# EAGLE design DMGC-CPU-01_1-3 (EAGLE 9.6.2)
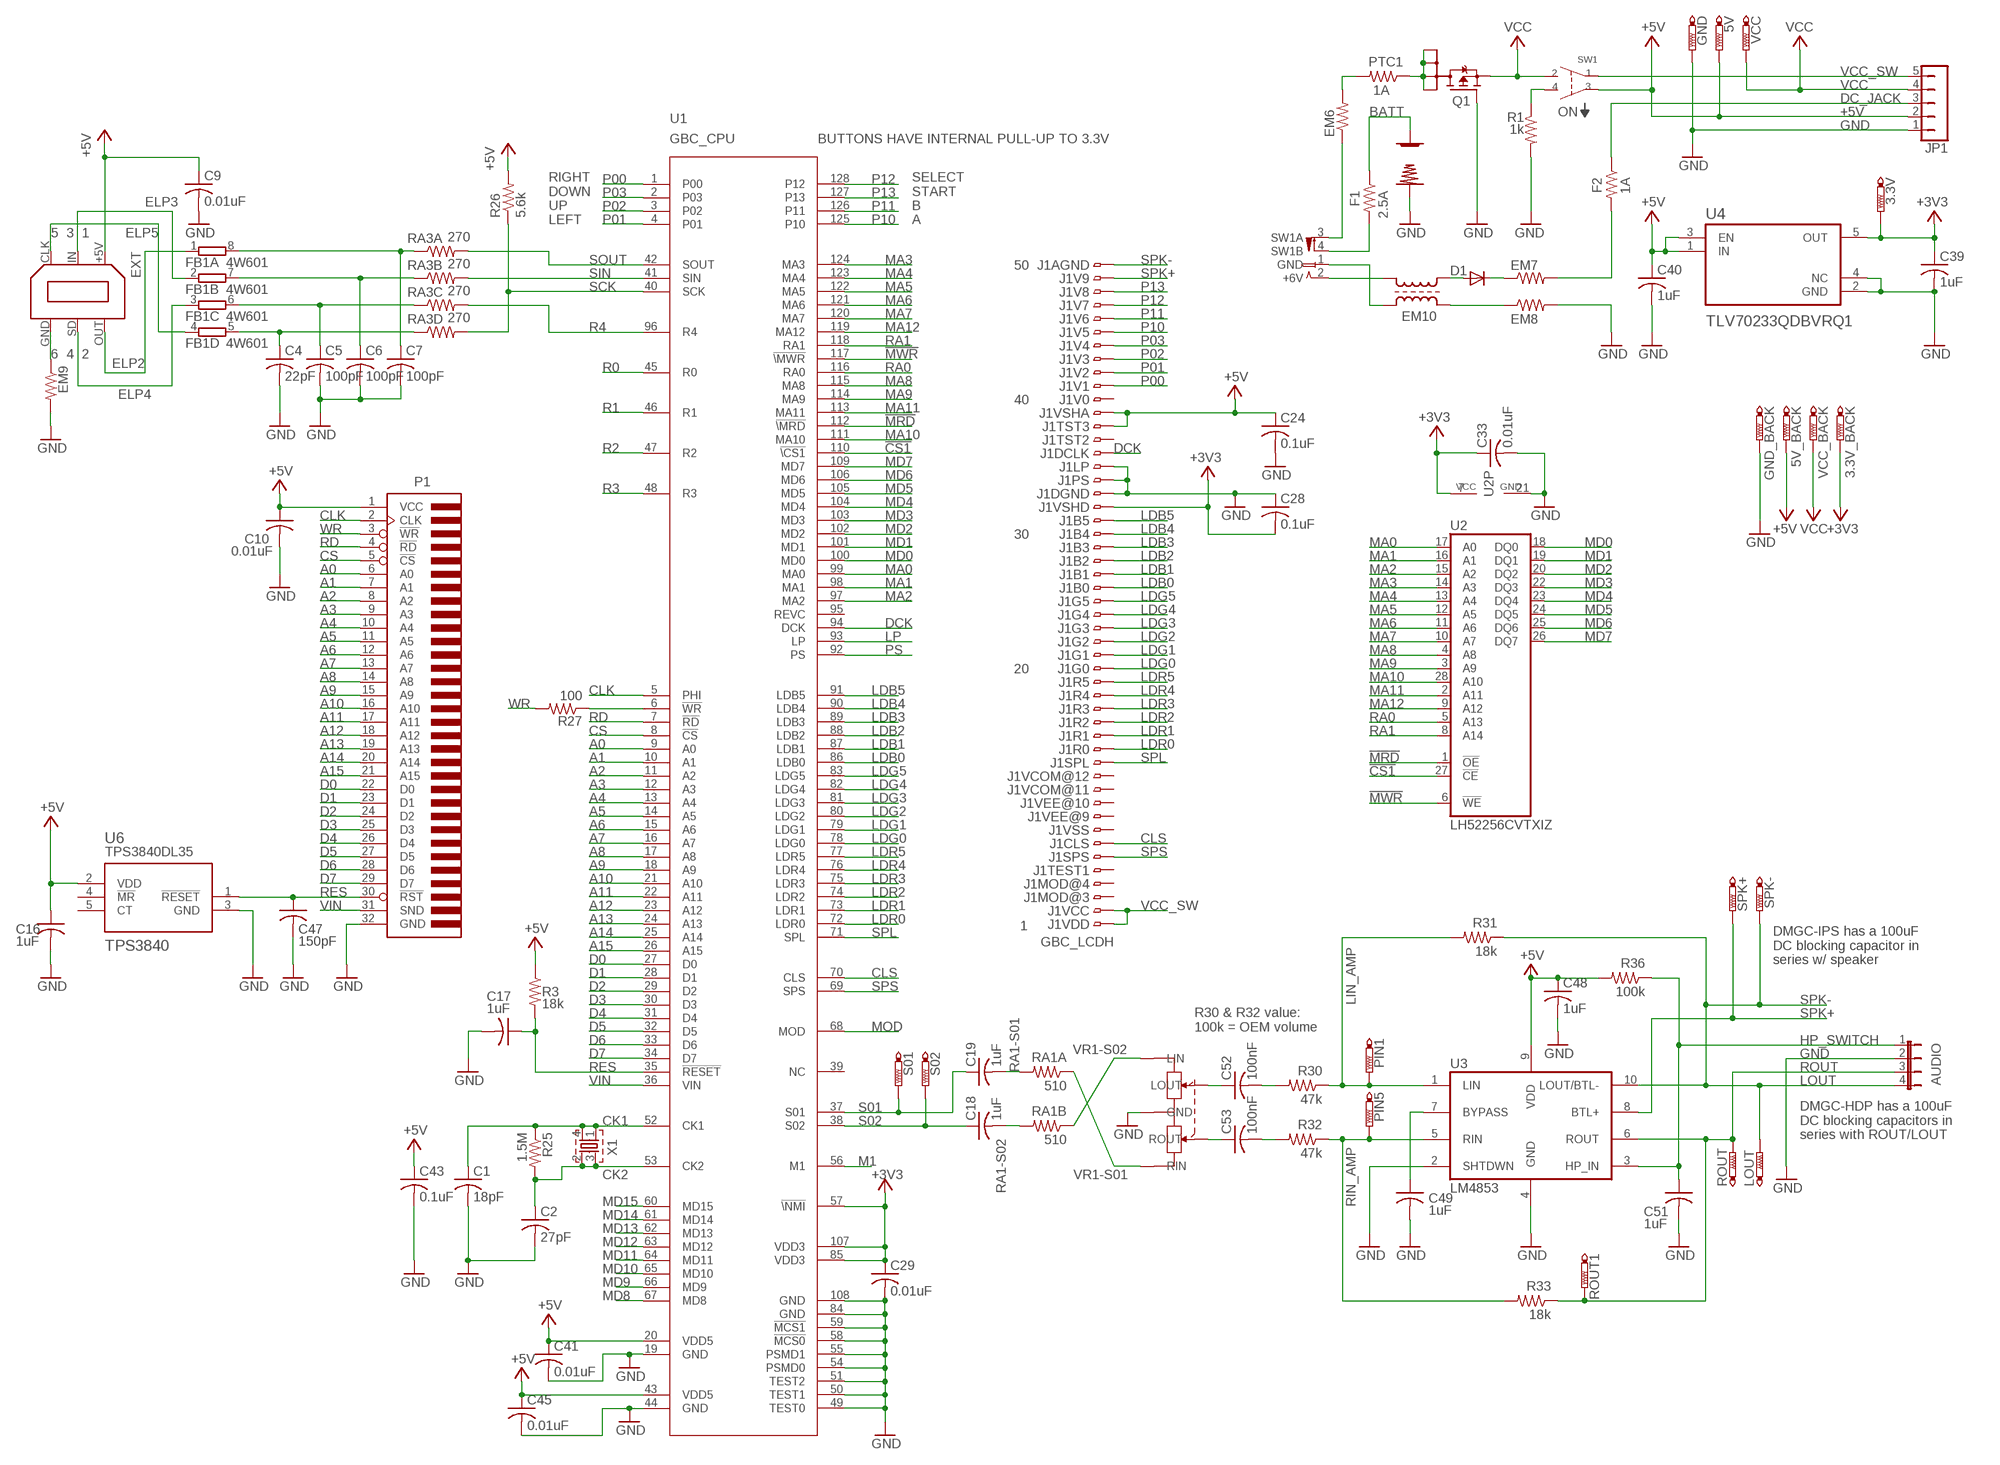
[diagram p0: schematic, sheet 1]

## Parts
3.3V  PTR1B1,27  [B1,27]
3.3V_BACK  PTR1B1,27  [B1,27]
5V  PTR1B1,27  [B1,27]
5V_BACK  PTR1B1,27  [B1,27]
+  DMG+BATTERY  [DMG+BATTERY]
-  DMG-BATTERY  [DMG-BATTERY]
AUDIO  JP4E  [JP4]
C1  18pF  C-USC0603  [C0603]
C2  27pF  C-USC0603  [C0603]
C4  22pF  C-USC0603  [C0603]
C5  100pF  C-USC0603  [C0603]
C6  100pF  C-USC0603  [C0603]
C7  100pF  C-USC0603  [C0603]
C9  0.01uF  C-USC0603  [C0603]
C10  0.01uF  C-USC0603  [C0603]
C16  1uF  C-USC0603  [C0603]
C17  1uF  C-USC0603  [C0603]
C18  1uF  C-USC0603  [C0603]
C19  1uF  C-USC0603  [C0603]
C24  0.1uF  C-USC0603  [C0603]
C28  0.1uF  C-USC0603  [C0603]
C29  0.01uF  C-USC0603  [C0603]
C33  0.01uF  C-USC0603  [C0603]
C39  1uF  C-USC0603  [C0603]
C40  1uF  C-USC0603  [C0603]
C41  0.01uF  C-USC0603  [C0603]
C43  0.1uF  C-USC0603  [C0603]
C45  0.01uF  C-USC0603  [C0603]
C47  150pF  C-USC0603  [C0603]
C48  1uF  C-USC0603  [C0603]
C49  1uF  C-USC0603  [C0603]
C51  1uF  C-USC0603  [C0603]
C52  100nF  C-USC0603  [C0603]
C53  100nF  C-USC0603  [C0603]
D1  CGRM4001-G  [SOD-123_MINI-SMA]
DCJACK  DMG-PWRJACKNOHOLE  [DMG-PWRJACK_NOHOLE]
EM6  BLM21P221SG  R-US_R0805  [R0805]
EM7  BLM21P221SG  R-US_R0805  [R0805]
EM8  BLM21P221SG  R-US_R0805  [R0805]
EM9  BLM21P221SG  R-US_R0603  [R0603]
EM10  ACM4532-801-2PA  [ACM4532]
EXT  LINKPORTDMG-LINK-SHORT  LINKPORTDMG-LINK  [DMG-LINK]
F1  2.5A  R-US_R1206  [R1206]
F2  1A  R-US_R1206  [R1206]
FB1  4W601  4R-NEXB38V  [EXB38V]
GND  PTR1B1,27  [B1,27]
GND_BACK  PTR1B1,27  [B1,27]
J1  GBC_LCDH  [FH12-50S-0.5SH]
JP1  JP5  [JP5]
LOUT  PTR1B1,27  [B1,27]
P1  GBCONN  [GBCONN]
PIN1  PTR1B1,27  [B1,27]
PIN5  PTR1B1,27  [B1,27]
PTC1  1A  R-US_R1206  [R1206]
Q1  SI1401EDH  [SOT363_INFINEON]
R1  1k  R-US_R0603  [R0603]
R3  18k  R-US_R0603  [R0603]
R25  1.5M  R-US_R0603  [R0603]
R26  5.6k  R-US_R0603  [R0603]
R27  100  R-US_R0603  [R0603]
R30  47k  R-US_R0603  [R0603]
R31  18k  R-US_R0603  [R0603]
R32  47k  R-US_R0603  [R0603]
R33  18k  R-US_R0603  [R0603]
R36  100k  R-US_R0603  [R0603]
RA1A  510  R-US_R0603  [R0603]
RA1B  510  R-US_R0603  [R0603]
RA3A  270  R-US_R0603  [R0603]
RA3B  270  R-US_R0603  [R0603]
RA3C  270  R-US_R0603  [R0603]
RA3D  270  R-US_R0603  [R0603]
ROUT  PTR1B1,27  [B1,27]
ROUT1  PTR1B1,27  [B1,27]
S01  PTR1B1,27  [B1,27]
S02  PTR1B1,27  [B1,27]
SPK+  PTR1B1,27  [B1,27]
SPK-  PTR1B1,27  [B1,27]
SW1  DMG-SW  [DMG-SWITCH]
U1  GBC_CPU  [QFP-128]
U2  LH52256CVTXIZ  [TSOP1-28]
U3  LM4853  [VSSOP10]
U4  TLV70233QDBVRQ1  [SOT95P280X145-5N]
U6  TPS3840  [SOT-23-5]
VCC  PTR1B1,27  [B1,27]
VCC_BACK  PTR1B1,27  [B1,27]
VR1  10K  DMG-POT  [DMG-POT]
X1  8.388608MHZ12SMX-B-4-PAD  [7.5X5-4-PAD]

## Nets
!CS1: U1.110(!\CS1) U2.27(!CE)
!MRD: U1.112(!\MRD) U2.1(!OE)
!MWR: U1.117(!\MWR) U2.6(!WE)
+3V3: 3.3V.TP 3.3V_BACK.TP C28.2 C29.1 C33.1 C39.1 J1.32 U1.57(!\NMI) U1.85(VDD3) U1.107(VDD3) U2.7(VCC) U4.5(OUT)
+5V: 5V.TP 5V_BACK.TP C9.1 C10.1 C16.1 C24.1 C40.1 C41.1 C43.1 C45.1 C48.1 EXT.+5V J1.38 J1.39 JP1.2 P1.1(VCC) R3.1 R26.2 R36.2 SW1.P$3 U1.20(VDD5) U1.43(VDD5) U3.9(VDD) U4.1(IN) U4.3(EN) U6.2(VDD)
A0: P1.6(A0) U1.9(A0)
A1: P1.7(A1) U1.10(A1)
A2: P1.8(A2) U1.11(A2)
A3: P1.9(A3) U1.12(A3)
A4: P1.10(A4) U1.13(A4)
A5: P1.11(A5) U1.14(A5)
A6: P1.12(A6) U1.15(A6)
A7: P1.13(A7) U1.16(A7)
A8: P1.14(A8) U1.17(A8)
A9: P1.15(A9) U1.18(A9)
A10: P1.16(A10) U1.21(A10)
A11: P1.17(A11) U1.22(A11)
A12: P1.18(A12) U1.23(A12)
A13: P1.19(A13) U1.24(A13)
A14: P1.20(A14) U1.25(A14)
A15: P1.21(A15) U1.26(A15)
BATT: +.P$1 F1.1
BATT_DC: DCJACK.3(SW1A) EM6.1
CK1: C1.1 R25.1 U1.52(CK1) X1.1 X1.4
CK2: C2.1 R25.2 U1.53(CK2) X1.2 X1.3
CLK: P1.2(CLK) U1.5(PHI)
CLS: J1.7 U1.70(CLS)
CS: P1.5(!CS) U1.8(!CS)
D0: P1.22(D0) U1.27(D0)
D1: P1.23(D1) U1.28(D1)
D2: P1.24(D2) U1.29(D2)
D3: P1.25(D3) U1.30(D3)
D4: P1.26(D4) U1.31(D4)
D5: P1.27(D5) U1.32(D5)
D6: P1.28(D6) U1.33(D6)
D7: P1.29(D7) U1.34(D7)
DC_JACK: F2.1 JP1.3
DCK: J1.36 U1.94(DCK)
ELP2: EXT.OUT FB1.1
ELP3: EXT.IN FB1.2
ELP4: EXT.SD FB1.3
ELP5: EXT.CLK FB1.4
EM10_EM8: EM8.1 EM10.3
EM10_GND: DCJACK.1(GND) EM10.2
EM10_POS: DCJACK.2(+6V) EM10.1
GND: -.P$1 AUDIO.2 C1.2 C2.2 C4.2 C5.2 C6.2 C7.2 C9.2 C10.2 C16.2 C17.2 C24.2 C28.1 C29.2 C33.2 C39.2 C40.2 C41.2 C43.2 C45.2 C47.2 C48.2 C49.2 C51.2 EM8.2 EM9.2 GND.TP GND_BACK.TP J1.33 J1.34 J1.35 JP1.1 P1.32(GND) Q1.3(G) R1.2 U1.19(GND) U1.44(GND) U1.49(TEST0) U1.50(TEST1) U1.51(TEST2) U1.54(PSMD0) U1.55(PSMD1) U1.58(!MCS0) U1.59(!MCS1) U1.84(GND) U1.108(GND) U2.21(GND) U3.2(SHTDWN) U3.4(GND) U4.2(GND) U4.4(NC) U6.3(GND) VR1.P$1(GND)
HP_SWITCH: AUDIO.1 C51.1 R36.1 U3.3(HP_IN)
LDB0: J1.26 U1.86(LDB0)
LDB1: J1.27 U1.87(LDB1)
LDB2: J1.28 U1.88(LDB2)
LDB3: J1.29 U1.89(LDB3)
LDB4: J1.30 U1.90(LDB4)
LDB5: J1.31 U1.91(LDB5)
LDG0: J1.20 U1.78(LDG0)
LDG1: J1.21 U1.79(LDG1)
LDG2: J1.22 U1.80(LDG2)
LDG3: J1.23 U1.81(LDG3)
LDG4: J1.24 U1.82(LDG4)
LDG5: J1.25 U1.83(LDG5)
LDR0: J1.14 U1.72(LDR0)
LDR1: J1.15 U1.73(LDR1)
LDR2: J1.16 U1.74(LDR2)
LDR3: J1.17 U1.75(LDR3)
LDR4: J1.18 U1.76(LDR4)
LDR5: J1.19 U1.77(LDR5)
LIN_AMP: PIN1.TP R30.1 R31.2 U3.1(LIN)
LP: U1.93(LP)
M1: U1.56(M1)
MA0: U1.99(MA0) U2.17(A0)
MA1: U1.98(MA1) U2.16(A1)
MA2: U1.97(MA2) U2.15(A2)
MA3: U1.124(MA3) U2.14(A3)
MA4: U1.123(MA4) U2.13(A4)
MA5: U1.122(MA5) U2.12(A5)
MA6: U1.121(MA6) U2.11(A6)
MA7: U1.120(MA7) U2.10(A7)
MA8: U1.115(MA8) U2.4(A8)
MA9: U1.114(MA9) U2.3(A9)
MA10: U1.111(MA10) U2.28(A10)
MA11: U1.113(MA11) U2.2(A11)
MA12: U1.119(MA12) U2.9(A12)
MD0: U1.100(MD0) U2.18(DQ0)
MD1: U1.101(MD1) U2.19(DQ1)
MD2: U1.102(MD2) U2.20(DQ2)
MD3: U1.103(MD3) U2.22(DQ3)
MD4: U1.104(MD4) U2.23(DQ4)
MD5: U1.105(MD5) U2.24(DQ5)
MD6: U1.106(MD6) U2.25(DQ6)
MD7: U1.109(MD7) U2.26(DQ7)
MD8: U1.67(MD8)
MD9: U1.66(MD9)
MD10: U1.65(MD10)
MD11: U1.64(MD11)
MD12: U1.63(MD12)
MD13: U1.62(MD13)
MD14: U1.61(MD14)
MD15: U1.60(MD15)
MOD: U1.68(MOD)
N$1: C7.1 FB1.8 RA3A.1
N$2: C6.1 FB1.7 RA3B.1
N$4: C52.2 R30.2
N$5: C53.2 R32.2
N$6: C5.1 FB1.6 RA3C.1
N$7: C52.1 VR1.P$3(LOUT)
N$8: R27.1 U1.6(!WR)
N$9: C4.1 FB1.5 RA3D.1
N$10: C53.1 VR1.P$2(ROUT)
N$11: R1.1 SW1.P$4
N$13: D1.C EM7.1
N$15: EM7.2 F2.2
N$16: EM6.2 PTC1.2
N$24: EM9.1 EXT.GND
N$29: C49.1 U3.7(BYPASS)
P00: J1.41 U1.1(P00)
P01: J1.42 U1.4(P01)
P02: J1.43 U1.3(P02)
P03: J1.44 U1.2(P03)
P10: J1.45 U1.125(P10)
P11: J1.46 U1.126(P11)
P12: J1.47 U1.128(P12)
P13: J1.48 U1.127(P13)
PFET_DRAIN: PTC1.1 Q1.1(D1) Q1.2(D2) Q1.5(D5) Q1.6(D6)
PS: U1.92(PS)
R0: U1.45(R0)
R1: U1.46(R1)
R2: U1.47(R2)
R3: U1.48(R3)
R4: RA3C.2 U1.96(R4)
RA0: U1.116(RA0) U2.5(A13)
RA1: U1.118(RA1) U2.8(A14)
RA1-S01: C19.2 RA1A.2
RA1-S02: C18.2 RA1B.2
RD: P1.4(!RD) U1.7(!RD)
RES: C17.1 C47.1 P1.30(!RST) R3.2 U1.35(!RESET) U6.1(!RESET)
RIN_AMP: PIN5.TP R32.1 R33.2 U3.5(RIN)
ROUT: AUDIO.3 R33.1 ROUT1.TP ROUT.TP U3.6(ROUT)
RPP: D1.A EM10.4
S01: C19.1 S01.TP U1.37(S01)
S02: C18.1 S02.TP U1.38(S02)
SCK: R26.1 RA3D.2 U1.40(SCK)
SIN: RA3B.2 U1.41(SIN)
SOUT: RA3A.2 U1.42(SOUT)
SPK+: J1.49 SPK+.TP U3.8(BTL+)
SPK-: AUDIO.4 J1.50 LOUT.TP R31.1 SPK-.TP U3.10(LOUT/BTL-)
SPL: J1.13 U1.71(SPL)
SPS: J1.6 U1.69(SPS)
SW1B: DCJACK.4(SW1B) F1.2
VCC: JP1.4 Q1.4(S) SW1.P$2 VCC.TP VCC_BACK.TP
VCC_SW: J1.1 J1.2 JP1.5 SW1.P$1
VIN: P1.31(SND) U1.36(VIN)
VR1-S01: RA1A.1 VR1.P$5(RIN)
VR1-S02: RA1B.1 VR1.P$4(LIN)
WR: P1.3(!WR) R27.2
Unconnected: J1.3 J1.4 J1.5 J1.8 J1.9 J1.10 J1.11 J1.12 J1.37 J1.40 U1.39(NC) U1.95(REVC) U6.4(!MR) U6.5(CT)

## Notes on the sheet
- BUTTONS HAVE INTERNAL PULL-UP TO 3.3V
- RIGHT
  DOWN
  UP
  LEFT
- SELECT
  START
  B
  A
- 5  3  1
- 50
- 6  4  2
- 40
- 30
- 20
- TPS3840DL35
- 1
- DMGC-IPS has a 100uF 
  DC blocking capacitor in
  series w/ speaker
- R30 & R32 value:
  100k = OEM volume
- LOUT
- DMGC-HDP has a 100uF 
  DC blocking capacitors in
  series with ROUT/LOUT

## Power pins joined to a net without a drawn wire
GND: EXT.SHIELD1(GND) EXT.SHIELD(GND) SW1.P$7(GND) SW1.P$8(GND) VR1.P$6(GND) VR1.P$7(GND)

## Library data of the parts
3.3V 3.3V_BACK 5V 5V_BACK GND GND_BACK LOUT PIN1 PIN5 ROUT ROUT1 S01 S02 SPK+ SPK- VCC VCC_BACK = testpad:PTR1: TEST PIN
+ = Game Boy:DMG+BATTERY
- = Game Boy:DMG-BATTERY
AUDIO = jumper:JP4E: JUMPER
C1 C2 C4-C7 C9 C10 C16-C19 C24 C28 C29 C33 C39-C41 C43 C45 C47-C49 C51-C53 = rcl:C-US: CAPACITOR, American symbol; SPICEPREFIX: C
D1 = diode:CGRM400*-G: Molded plasitc,JEDEC SOD-123/Mini SMA Source: Comchip CGRM4001-G.pdf
DCJACK = Game Boy:DMG-PWRJACK
EM6-EM9 F1 F2 PTC1 R1 R3 R25-R27 R30-R33 R36 RA1A RA1B RA3A RA3B RA3C RA3D = rcl:R-US_: RESISTOR, American symbol; SPICEPREFIX: R
EM10 = gameboy:ACM4532-801-2P: TRANSFORMER SMD transformer; OC_FARNELL: unknown; OC_NEWARK: unknown
EXT = Game Boy:LINKPORT
FB1 = resistor-dil:4R-N: Array Chip Resistor Source: RS Component / Phycomp; OC_FARNELL: unknown; OC_NEWARK: unknown
J1 = gameboy:GBC_LCD: 0.5mm Pitch Connectors For FPC/FFC Source: Data sheet <http://www.hirose.co.jp/cataloge_hp/e58605370.pdf>; MPN: FH12-50S-0.5SH(55); OC_FARNELL: 1324557; OC_NEWARK: 34M6181
JP1 = jumper:JP5: JUMPER
P1 = GameboyDev:GBCONN
Q1 = transistor-fet:SI1401EDH: OptiMOS(R)-P Small-Signal-Transistor Dual P-Channel, Enhancement mode, Super Logic Level (2.5 V rated) Source: http://www.infineon.com/upload/Document/BSD223P_Rev1.3.pdf
SW1 = Game Boy:DMG-SW: DMG Power Switch Pins 1 and 2 are only connected when the power is ON, pins 3 and 4 are only connected when the power is OFF.
U1 = gameboy:GBC_CPU: lfxp3e_tqfp144 edit this description Auto generated by make-symbol-device-package-bsdl.ulp Rev. 20 Source: lfxp3e_tqfp144.bsm
U2 = gameboy:LH52256CVT: 256K (32K x 8) CMOS-Static RAM Source: http://download.cypress.com.edgesuite.net/design_resources/datasheets/contents/cy62256_8.pdf
U3 = gameboy:LM4853: LM4853
U4 = TLV70233QDBVRQ1:TLV70233QDBVRQ1: Check availability <https://pricing.snapeda.com/parts/TLV70233QDBVRQ1/Texas%20Instruments/view-part?ref=eda>; AVAILABILITY: In Stock; DESCRIPTION: Automotive 300-mA, high-PSRR, low-IQ, low-dropout voltage regulator with enable 5-SOT-23 -40 to 125; MF: Texas Instruments; MP: TLV70233QDBVRQ1; PACKAGE: SOT-23-5 Texas Instruments; PRICE: None; PURCHASE-URL: https://pricing.snapeda.com/search/part/TLV70233QDBVRQ1/?ref=eda
U6 = SOT95P280X145-5N:TPS3840
VR1 = Game Boy:DMG-POT
X1 = gameboy:8.388608MHZ: CRYSTALS WITH CAN GROUNDED

## Net classes
1 VCC: width 0.203 mm

## Board
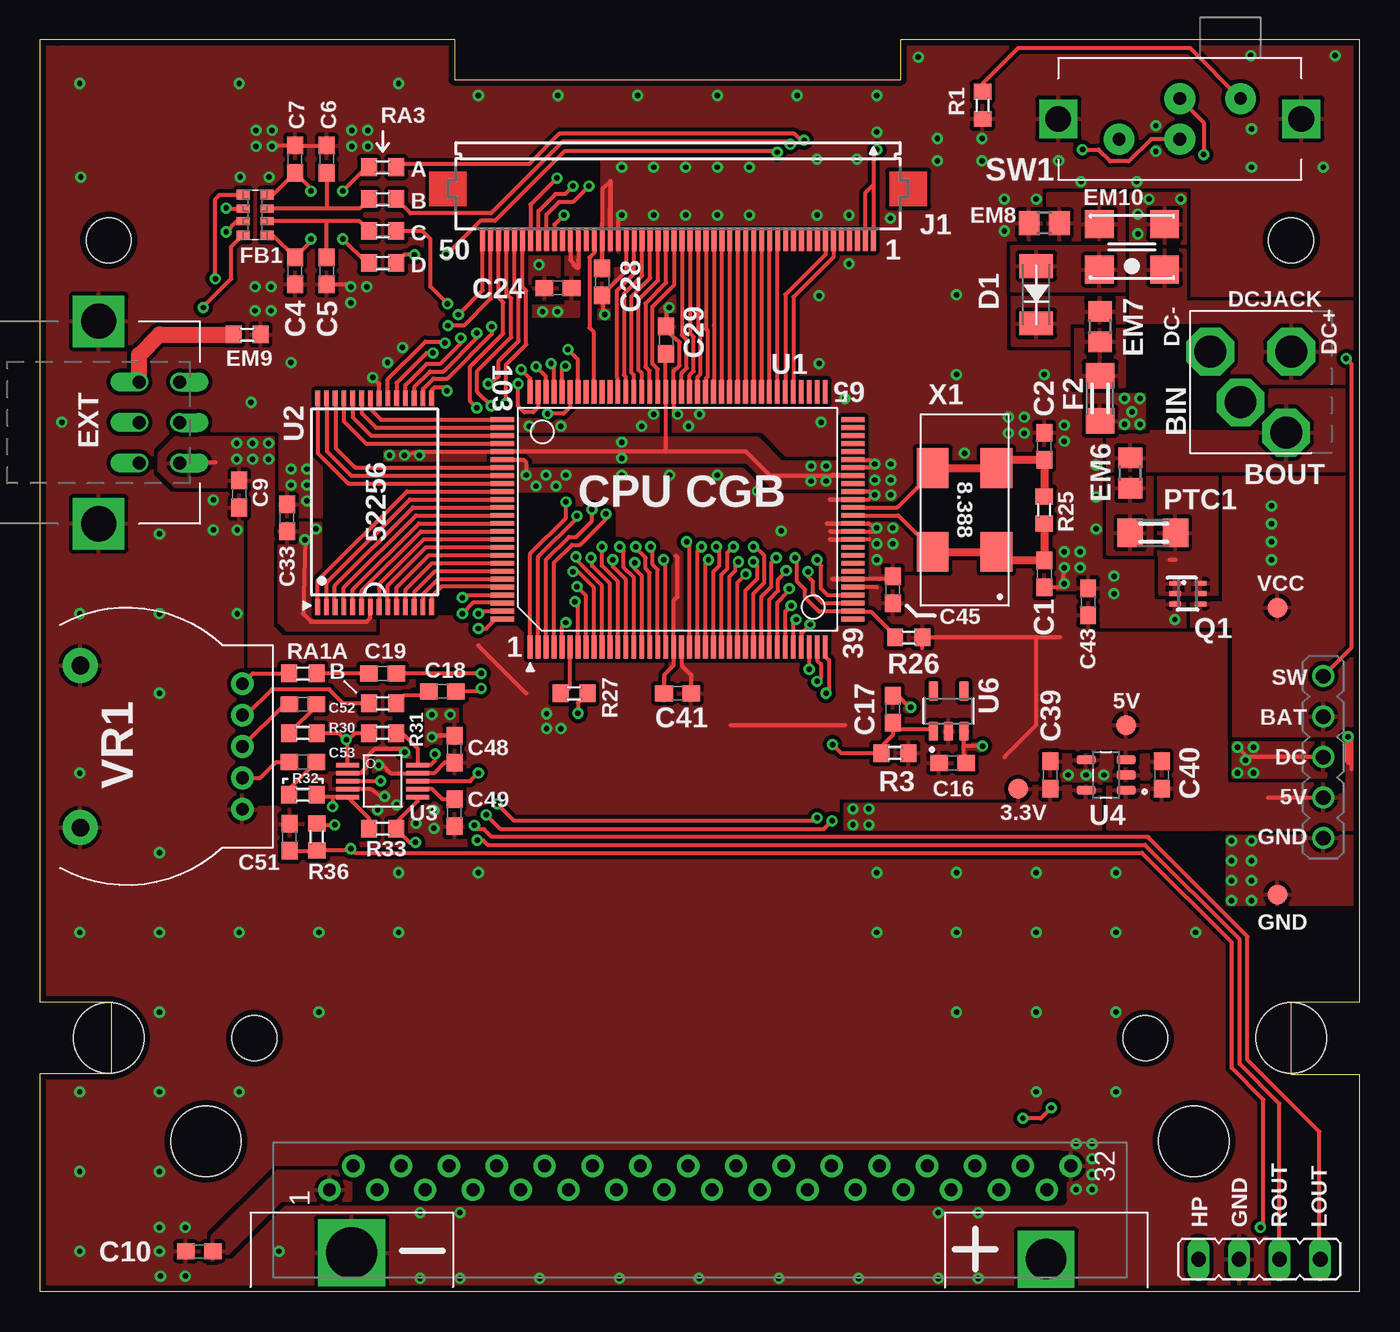
[diagram p1: board, top side]
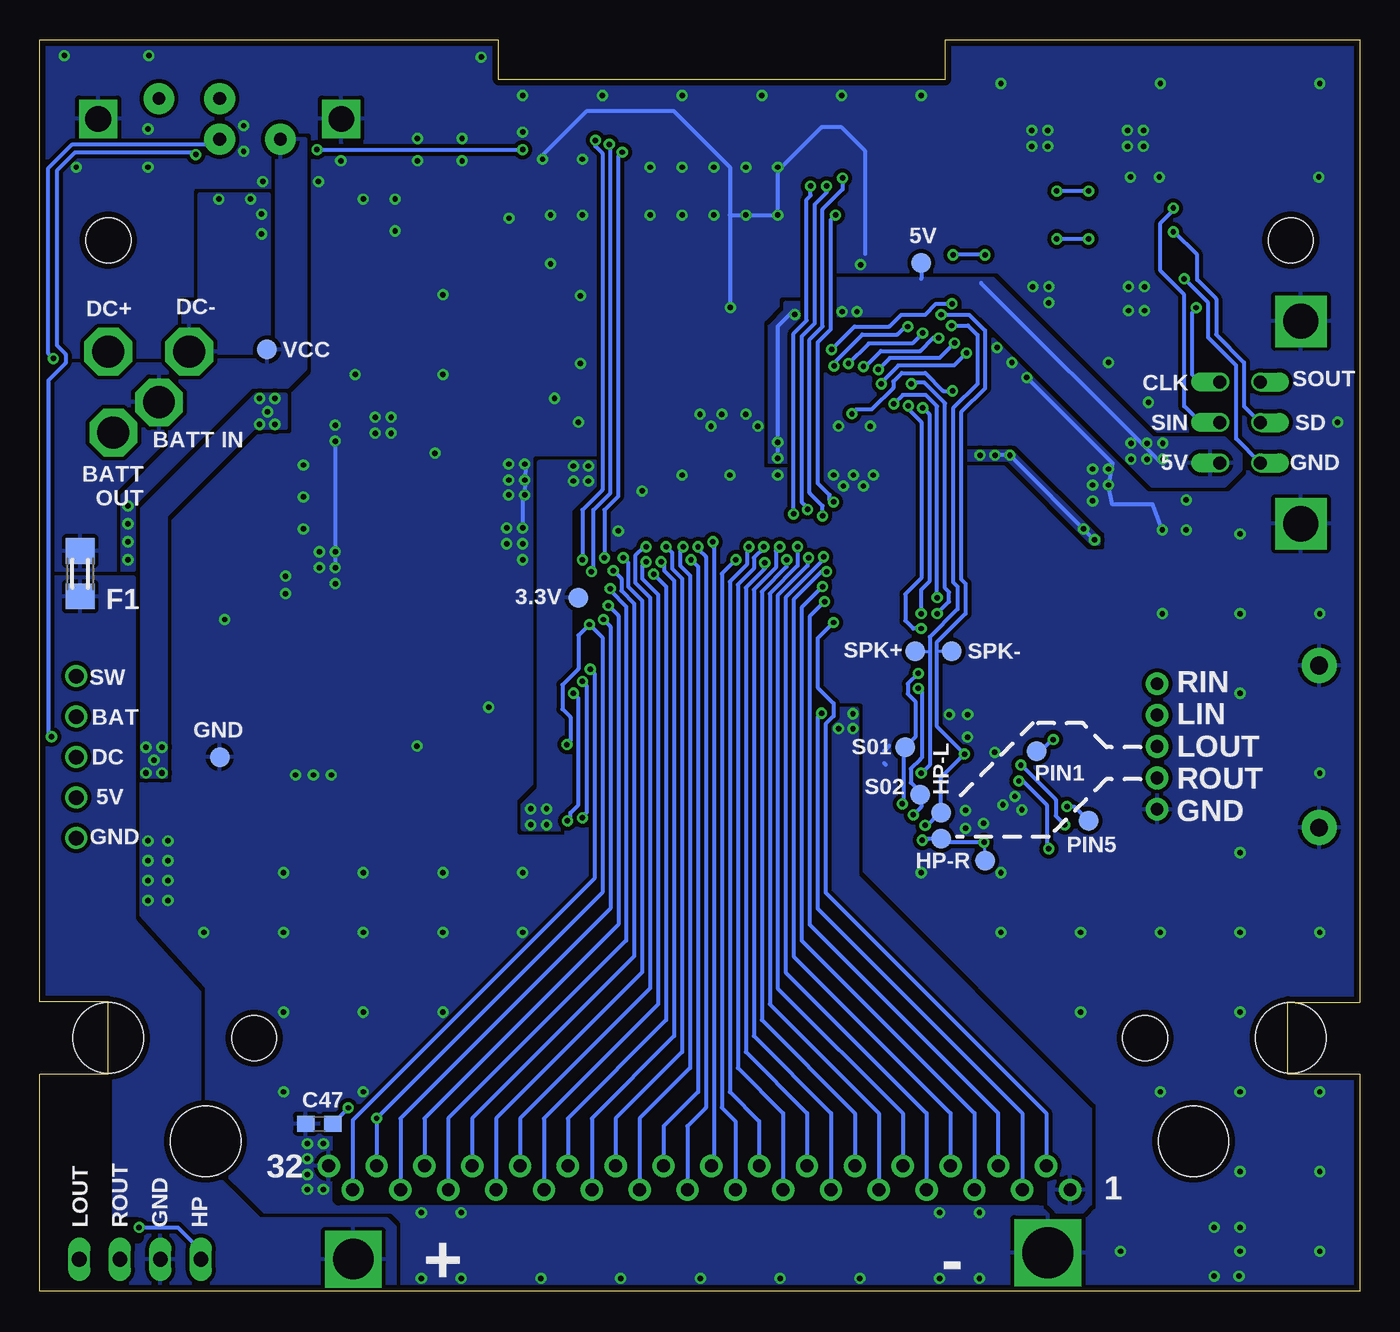
[diagram p2: board, bottom side, seen from below]

Size 82.78 x 78.49 mm. Coordinates in mm from the lower left corner, seen from the top.
Outline: 0,0 82.78,0 82.78,13.59 78.5,13.59 78.5,18.16 82.78,18.16 82.78,78.49 54,78.49 54,76 26,76 26,78.49 1.04,78.49 1.04,78.48 0,78.48 0,18.12 4.5,18.12 4.5,13.62 0,13.62 0,0
Copper layers (1*16): Top 0.0356mm / dielectric 1.5011mm / Bottom 0.0356mm
Design rules "jlcpcb *": minimum track width 8mil, minimum drill 13mil, track to track 7mil, track to pad 7mil, pad to pad 7mil, via to via 7mil, smd to smd 5mil, copper to edge 15mil, drill to drill 22mil, minimum pad ring 7mil, minimum via ring 7mil, stop-mask expansion 2.5mil, vias tented up to drill 14mil, thermal gap 10mil
Holes 2.8 mm at 4.32,65.91 78.49,65.91 13.46,15.88 69.34,15.88
Holes 4.41 mm at 10.41,9.4 72.39,9.4 4.32,15.88 78.49,15.88
tKeepout: area 0.3,61.8 to 8.4,70; area 74.4,61.8 to 82.6,70; area -1,5 to 84,27
tRestrict: area 18.2,47.5 to 18.5,52; area 22.5,35.5 to 22.7,36.5; area 29.5,49 to 33,49.7; area 35.5,47 to 35.7,48.7; area 19.7,5.8 to 64,8.4; area 23.5,34 to 26.2,37.5; area 13.9,30.8 to 14.8,32.4; area 34.8,66 to 36.2,66.4; area 35.2,64.6 to 36.1,64.8; area 33.1,66.8 to 34.8,71; area 50.9,47 to 51.1,52.1; area 73.6,23.5 to 82.4,28.5; 4 more areas
bRestrict: area 19.7,5.8 to 64,8.4; area 63.5,8.5 to 64,9.9; area 76.6,3.4 to 79.8,15.4

### Footprints (pad centres in the part's own frame; a part is rotated, then mirrored left to right if it is on the bottom)
B1,27 = smd 1.27 x 1.27: TP 0,0
DMG+BATTERY = drill 2.54 pad 3.302 square: P$1 0,0
DMG-BATTERY = drill 3.2 pad 4 square: P$1 0,0.5
JP4 = drill 0.914 long: 1 -3.81,0; 2 -1.27,0; 3 1.27,0; 4 3.81,0
C0603 = smd 1.1 x 1: 1 -0.85,0; 2 0.85,0
SOD-123_MINI-SMA = smd 1.5 x 2.1: A 1.8,0; C -1.8,0
DMG-PWRJACK_NOHOLE = drill 2 octagon: 1 -2.54,0; 2 2.54,0; 3 2.223,-5.08; 4 -0.635,-3.175
R0805 = smd 1.3 x 1.5: 1 -0.95,0; 2 0.95,0
R0603 = smd 1 x 1.1: 1 -0.85,0; 2 0.85,0
ACM4532 = smd 1.8 x 1.75: 1 -2.05,1.425; 2 -2.05,-1.425; 3 2.05,-1.425; 4 2.05,1.425
DMG-LINK = drill 0.8 offset: +5V 2.54,5.08; CLK -2.54,5.08; GND -2.54,2.54; IN 0,5.08; OUT 2.54,2.54; SD 0,2.54 | drill 2.2 square: SHIELD -6.35,0; SHIELD1 6.35,0
R1206 = smd 1.6 x 1.803: 1 -1.422,0; 2 1.422,0
EXB38V = smd 0.6 x 0.8: 1 -1.275,-0.75; 4 1.275,-0.75; 5 1.275,0.75; 8 -1.275,0.75 | smd 0.5 x 0.8: 2 -0.4,-0.75; 3 0.4,-0.75; 6 0.4,0.75; 7 -0.4,0.75
FH12-50S-0.5SH = smd 0.3 x 1.3: 1 -12.25,3.25; 2 -11.75,3.25; 3 -11.25,3.25; 4 -10.75,3.25; 5 -10.25,3.25; 6 -9.75,3.25; 7 -9.25,3.25; 8 -8.75,3.25; 9 -8.25,3.25; 10 -7.75,3.25; 11 -7.25,3.25; 12 -6.75,3.25; 13 -6.25,3.25; 14 -5.75,3.25; 15 -5.25,3.25; 16 -4.75,3.25; 17 -4.25,3.25; 18 -3.75,3.25; 19 -3.25,3.25; 20 -2.75,3.25; 21 -2.25,3.25; 22 -1.75,3.25; 23 -1.25,3.25; 24 -0.75,3.25; 25 -0.25,3.25; 26 0.25,3.25; 27 0.75,3.25; 28 1.25,3.25; 29 1.75,3.25; 30 2.25,3.25; 31 2.75,3.25; 32 3.25,3.25; 33 3.75,3.25; 34 4.25,3.25; 35 4.75,3.25; 36 5.25,3.25; 37 5.75,3.25; 38 6.25,3.25; 39 6.75,3.25; 40 7.25,3.25; 41 7.75,3.25; 42 8.25,3.25; 43 8.75,3.25; 44 9.25,3.25; 45 9.75,3.25; 46 10.25,3.25; 47 10.75,3.25; 48 11.25,3.25; 49 11.75,3.25; 50 12.25,3.25
JP5 = drill 0.914: 1 -5.08,0; 2 -2.54,0; 3 0,0; 4 2.54,0; 5 5.08,0
GBCONN = drill 0.813 pad 1.397: 1 0,0; 2 -1.5,1.5; 3 0,3; 4 -1.5,4.5; 5 0,6; 6 -1.5,7.5; 7 0,9; 8 -1.5,10.5; 9 0,12; 10 -1.5,13.5; 11 0,15; 12 -1.5,16.5; 13 0,18; 14 -1.5,19.5; 15 0,21; 16 -1.5,22.5; 17 0,24; 18 -1.5,25.5; 19 0,27; 20 -1.5,28.5; 21 0,30; 22 -1.5,31.5; 23 0,33; 24 -1.5,34.5; 25 0,36; 26 -1.5,37.5; 27 0,39; 28 -1.5,40.5; 29 0,42; 30 -1.5,43.5; 31 0,45; 32 -1.5,46.5
SOT363_INFINEON = smd 0.3 x 0.7: 1 -0.65,-0.8; 2 0,-0.8; 3 0.65,-0.8; 4 0.65,0.8; 5 0,0.8; 6 -0.65,0.8
DMG-SWITCH = drill 0.8 pad 1.93: P$1 0,-1.27; P$2 -3.81,-1.27; P$3 0,1.27; P$4 3.81,1.27 | drill 1.6 square: P$7 -7.62,0; P$8 7.62,0
QFP-128 = smd 0.3 x 1.45: 1 -8.25,-4.5; 2 -7.75,-4.5; 3 -7.25,-4.5; 4 -6.75,-4.5; 5 -6.25,-4.5; 6 -5.75,-4.5; 7 -5.25,-4.5; 8 -4.75,-4.5; 9 -4.25,-4.5; 10 -3.75,-4.5; 11 -3.25,-4.5; 12 -2.75,-4.5; 13 -2.25,-4.5; 14 -1.75,-4.5; 15 -1.25,-4.5; 16 -0.75,-4.5; 17 -0.25,-4.5; 18 0.25,-4.5; 19 0.75,-4.5; 20 1.25,-4.5; 21 1.75,-4.5; 22 2.25,-4.5; 23 2.75,-4.5; 24 3.25,-4.5; 25 3.75,-4.5; 26 4.25,-4.5; 27 4.75,-4.5; 28 5.25,-4.5; 29 5.75,-4.5; 30 6.25,-4.5; 31 6.75,-4.5; 32 7.25,-4.5; 33 7.75,-4.5; 34 8.25,-4.5; 35 8.75,-4.5; 36 9.25,-4.5; 37 9.75,-4.5; 38 10.25,-4.5; 65 10.25,11.5; 66 9.75,11.5; 67 9.25,11.5; 68 8.75,11.5; 69 8.25,11.5; 70 7.75,11.5; 71 7.25,11.5; 72 6.75,11.5; 73 6.25,11.5; 74 5.75,11.5; 75 5.25,11.5; 76 4.75,11.5; 77 4.25,11.5; 78 3.75,11.5; 79 3.25,11.5; 80 2.75,11.5; 81 2.25,11.5; 82 1.75,11.5; 83 1.25,11.5; 84 0.75,11.5; 85 0.25,11.5; 86 -0.25,11.5; 87 -0.75,11.5; 88 -1.25,11.5; 89 -1.75,11.5; 90 -2.25,11.5; 91 -2.75,11.5; 92 -3.25,11.5; 93 -3.75,11.5; 94 -4.25,11.5; 95 -4.75,11.5; 96 -5.25,11.5; 97 -5.75,11.5; 98 -6.25,11.5; 99 -6.75,11.5; 100 -7.25,11.5; 101 -7.75,11.5; 102 -8.25,11.5 | smd 1.45 x 0.3: 39 12,-2.75; 40 12,-2.25; 41 12,-1.75; 42 12,-1.25; 43 12,-0.75; 44 12,-0.25; 45 12,0.25; 46 12,0.75; 47 12,1.25; 48 12,1.75; 49 12,2.25; 50 12,2.75; 51 12,3.25; 52 12,3.75; 53 12,4.25; 54 12,4.75; 55 12,5.25; 56 12,5.75; 57 12,6.25; 58 12,6.75; 59 12,7.25; 60 12,7.75; 61 12,8.25; 62 12,8.75; 63 12,9.25; 64 12,9.75; 103 -10,9.75; 104 -10,9.25; 105 -10,8.75; 106 -10,8.25; 107 -10,7.75; 108 -10,7.25; 109 -10,6.75; 110 -10,6.25; 111 -10,5.75; 112 -10,5.25; 113 -10,4.75; 114 -10,4.25; 115 -10,3.75; 116 -10,3.25; 117 -10,2.75; 118 -10,2.25; 119 -10,1.75; 120 -10,1.25; 121 -10,0.75; 122 -10,0.25; 123 -10,-0.25; 124 -10,-0.75; 125 -10,-1.25; 126 -10,-1.75; 127 -10,-2.25; 128 -10,-2.75
TSOP1-28 = smd 1 x 0.3: 1 -6.6,3.575; 2 -6.6,3.025; 3 -6.6,2.475; 4 -6.6,1.925; 5 -6.6,1.375; 6 -6.6,0.825; 7 -6.6,0.275; 8 -6.6,-0.275; 9 -6.6,-0.825; 10 -6.6,-1.375; 11 -6.6,-1.925; 12 -6.6,-2.475; 13 -6.6,-3.025; 14 -6.6,-3.575; 15 6.5,-3.575; 16 6.5,-3.025; 17 6.5,-2.475; 18 6.5,-1.925; 19 6.5,-1.375; 20 6.5,-0.825; 21 6.5,-0.275; 22 6.5,0.275; 23 6.5,0.825; 24 6.5,1.375; 25 6.5,1.925; 26 6.5,2.475; 27 6.5,3.025; 28 6.5,3.575
VSSOP10 = smd 1.45 x 0.3: 1 -2.2,0.985; 2 -2.2,0.485; 3 -2.2,-0.015; 4 -2.2,-0.515; 5 -2.2,-1.015; 6 2.2,-1.015; 7 2.2,-0.515; 8 2.2,-0.015; 9 2.2,0.485; 10 2.2,0.985
SOT95P280X145-5N = smd 1.21 x 0.59: 1 -1.255,0.95; 2 -1.255,0; 3 -1.255,-0.95; 4 1.255,-0.95; 5 1.255,0.95
SOT-23-5 = smd 1.21 x 0.59: 1 -1.255,0.95; 2 -1.255,0; 3 -1.255,-0.95; 4 1.255,-0.95; 5 1.255,0.95
DMG-POT = drill 0.8 pad 1.422: P$1 -3.937,-5.08; P$2 -1.968,-5.08; P$3 0,-5.08; P$4 1.968,-5.08; P$5 3.937,-5.08 | drill 1.1 pad 2.184: P$6 -5.08,5.08; P$7 5.08,5.08
7.5X5-4-PAD = smd 2 x 2.5: 1 2,-2.625; 2 2,2.625; 3 -2,2.625; 4 -2,-2.625

### Placement (x,y rotation side)
3.3V  61.38,31.5 0 top
3.3V_BACK  49,43.5 0 bottom
5V  68.12,35.5 0 top
5V_BACK  27.5,64.5 0 bottom
+  63.12,2 0 top
-  19.56,1.91 0 top
AUDIO  76.5,2 0 top
C1  63,45 270 top
C2  63,53 90 top
C4  16,64 270 top
C5  18,64 270 top
C6  18,71 90 top
C7  16,71 90 top
C9  12.5,50 270 top
C10  10,2.5 180 top
C16  57.25,33.12 0 top
C17  53.5,36.5 90 top
C18  25.25,37.62 180 top
C19  21.5,38.75 180 top
C24  32.5,62.92 180 top
C28  35.27,63.3 270 top
C29  39.29,59.65 90 top
C33  15.5,48.5 90 top
C39  63.38,32.38 90 top
C40  70.38,32.38 90 top
C41  40,37.5 180 top
C43  65.75,43.25 90 top
C45  53.5,44 90 top
C47  65.25,10.5 180 bottom
C48  26,34 90 top
C49  26,30 270 top
C51  15.66,28.47 90 top
C52  16.5,36.81 0 top
C53  16.5,33.19 0 top
D1  62.5,62.5 90 top
DCJACK  75.95,58.93 0 top
EM6  68.39,51.31 270 top
EM7  66.5,60.5 270 top
EM8  63,67 180 top
EM9  13,60 0 top
EM10  68.5,65.5 180 top
EXT  3.68,54.48 270 top
F1  80.25,45 90 bottom
F2  66.5,56 90 top
FB1  13.5,67.5 270 top
GND  77.62,24.88 0 top
GND_BACK  71.5,33.5 0 bottom
J1  40.03,69.14 180 top
JP1  80.5,33.5 90 top
LOUT  26.25,30 0 bottom
P1  18.16,6.35 270 top
PIN1  20.25,33.88 0 bottom
PIN5  17,29.5 0 bottom
PTC1  69.81,47.56 180 top
Q1  72,43.75 270 top
R1  59.12,74.38 270 top
R3  53.62,33.75 180 top
R25  63,49 90 top
R26  54.5,41 0 top
R27  33.5,37.5 0 top
R30  16.5,35 180 top
R31  21.5,35 180 top
R32  16.5,31.12 180 top
R33  21.5,29 180 top
R36  17.38,28.5 90 top
RA1A  16.5,38.75 0 top
RA1B  21.5,36.88 0 top
RA3A  21.5,70.5 0 top
RA3B  21.5,68.5 0 top
RA3C  21.5,66.5 0 top
RA3D  21.5,64.5 0 top
ROUT  26.25,28.38 0 bottom
ROUT1  23.5,27 0 bottom
S01  28.5,34.12 0 bottom
S02  27.56,31.12 0 bottom
SPK+  27.88,40.12 0 bottom
SPK-  25.59,40.12 0 bottom
SW1  71.5,73.53 0 top
U1  39.01,44.91 0 top
U2  21,49.5 90 top
U3  21.5,32 0 top
U4  66.88,32.38 180 top
U6  57,36.38 90 top
VCC  77.62,42.88 0 top
VCC_BACK  68.53,59.06 0 bottom
VR1  7.62,34.16 90 top
X1  58,49 0 top

### Tracks (layer width: path | path; a pad name or v marks a point on that pad's centre or on a via)
!CS1
  Top 0.25: U2.27 18,55.48 18,52.69 19.53,51.16 U1.110
!MRD
  Top 0.25: U2.1 17.44,42.91 17.44,44.56 23.03,50.16 U1.112
!MWR
  Top 0.25: U2.6 20.19,42.91 20.19,43.94 23.91,47.66 U1.117
+3V3  (via drill 0.34)
  Top 0.203: v35.42,61.26 35.34,61.34
  Top 0.25: J1.32 36.78,63.99 35.27,62.49 C28.2 | v16.62,47.12 16.5,42.5 17,42 20.5,42 20.73,42.23 U2.7 | 39.25,52.66 44.28,52.66 45.81,51.12 50.97,51.12 U1.57 50.98,51.19 49.69,51.19 | 39.25,52.66 36.5,52.66 | 36.5,52.66 U1.107 23.72,52.66 v22.88,52.44 | C28.2 35.25,62.48 | v36.5,52.25 36.5,52.66 | C29.1 39.26,58.77 U1.85 39.25,52.66 | C28.2 35.33,62.4 35.33,61.36 35.34,61.34
  Bottom 0.25: v16.62,47.12 v21.94,52.44 v22.88,52.44 | 35.5,61.5 36.5,60.5 v36.5,52.25
  other vias: 49.31,51.75 49.31,50.81 48.38,50.81 48.38,51.75 36.5,53.25 23.81,52.44 17.31,47.81 51,29.25 51,30.25 52,29.25 52,30.25
  pour Top (isolate 0.25): 23,53.5 45,53.5 46.5,52 50.5,52 50.5,50.38 46,50.38 44.38,52 29,52 28.5,51.5 23,51.5 21.69,52 21.69,53
  pour Bottom (isolate 0.25): 36,52 37,52 37,60.5 36,61.5 36,62 34,62 34,61 35,60 35,53
  pour Top (isolate 0.25): 35.1,64.38 36.25,64.38 36.25,61 35.1,61
  pour Bottom (isolate 0.25): 21.88,52.69 16.38,47.25 16.38,46.88 16.75,46.88 22,52.12 25,52.12 25,52.69
  pour Top (isolate 0.25): 15,48.12 15,42 15.5,41.5 21,41.5 21,43.5 20.5,43.5 20.5,42.5 17.62,42.5 17.62,48.12
  pour Top (isolate 0.25): 50.5,30.5 50.5,27.5 66.88,27.5 66.53,27.84 66.53,31.62 61.12,31.62 61.12,30.5
  pour Bottom (isolate 0.25): 51.5,31.5 52.5,30.5 52.5,29 49.5,29 49.5,49 47.5,51 47.5,52 51.5,52
+5V  (via drill 0.33, 0.34, 0.35)
  Top 0.25: U1.20 40.25,39.25 40.85,38.65 C41.1 40.85,37.85 | 52.49,44.16 U1.43 | v21.25,33 21.5,33 22.02,32.48 U3.9 24.73,32.48 25.4,33.15 C48.1 | 43.35,35.5 50.5,35.5 | 55.35,40.35 R26.2 | 55.35,41.3 R26.2 | 64,41 62.5,41 | 62.5,41 R26.2 | 77.04,30.96 JP1.2 | R36.2 17.48,29.25 v18.5,29.25 | 60.5,33.5 62.5,35.5 62.5,41 | 27.5,40.5 30.5,37.5 | EXT.+5V 8.82,52 11,52 | SW1.P$3 73,73.3 v73,71.29 | 33.28,65.22 J1.39 33.28,64.67 33.78,64.17 33.78,64.57 33.78,64.67 J1.38 | 82.27,32.73 82.27,33.53 82.05,33.75 | 33.67,64.17 33.5,64.35
  Top 0.53: v82.05,34.77 82.14,34.69 82.14,33.25
  Bottom 0.25: v18.5,29.25 19.06,29.81 19.06,30.84 21.23,33 v21.25,33 | 12.5,52 23.74,63.24 | v73,71.29 73.12,71.41 80.58,71.41 81.72,70.27 81.72,59.33 81.16,58.77 81.16,58.21 82.25,57.12 82.25,34.98 v82.05,34.77 | 5V_BACK.TP 27.5,63.5
  other vias: 31.53,61.44 32.47,61.44 14.34,53.19 13.34,53.19 13.34,52.19 14.34,52.19 12.34,52.19 12.34,53.19 31.78,35.28 31.78,36.22 32.69,35.28
  pour Top (isolate 0.25, rank 2): 33,68.38 33,61.75 30.5,61.75 30.5,61.19 33.77,61.19 33.77,68.38
  pour Bottom (isolate 0.25, rank 2): 33.5,63.5 23,63.5 13,53.5 8.5,53.5 7.5,52.5 7.5,51.5 8.5,50.5 13,50.5 23.69,61.19 33.44,61.19 33.5,61.25
  pour Bottom (isolate 0.25, rank 2): 33.5,36.5 33.5,25 19.5,11 19.5,5.5 19,5 17.38,5 16.88,5.5 16.88,11.38 31.5,26 31.5,36.5
  pour Top (isolate 0.25, rank 2): 10.5,3.1 10.5,2 11.4,2 15.14,5.74 19.5,5.74 19.5,7 19,7.5 14.9,7.5
  pour Top (isolate 0.25): 19.5,34 19.5,32.5 23.5,32.5 23.5,33.5 22.5,34.5 20,34.5
  pour Top (isolate 0.25, rank 5): 8.5,53.5 7.5,52.5 7.5,51.5 8.5,50.5 13.12,50.5 13.12,39.12 26.62,39.12 26.62,34 25.75,34 25.75,29.5 50.25,29.5 50.25,30.75 62,30.75 62,31.88 63,31.88 63,33.88 67.5,33.88 67.5,32.12 67,31.62 67,29 83.12,29 83.12,34.38 74.38,34.38 74.38,41.22 65.78,41.22 65.78,43.53 62.5,43.52 62.5,46.5 55.12,46.5 55.12,44.75 51.62,44.75 51.62,43.12 48.25,39.75 31.75,39.75 29.25,42.25 21.25,42.25 21.25,41.25 15.5,41.25 14.62,42.12 14.62,53.5
A0  (via drill 0.34)
  Top 0.25: U1.9 34.76,44.12 33.75,45.12 v33.44,45.12
  Bottom 0.25: v33.44,45.12 33.75,45.12 35.5,43.38 35.5,21 25.66,11.16 P1.6
A1  (via drill 0.34)
  Top 0.25: U1.10 35.26,44.24 33.62,45.88 v33.62,46.06
  Bottom 0.25: v33.62,46.06 33.62,45.88 36,43.5 36,20 27.16,11.16 P1.7
A2  (via drill 0.34)
  Top 0.25: U1.11 35.76,44.37 34.62,45.5 34.62,46 v34.56,46
  Bottom 0.25: v34.56,46 34.62,45.94 34.62,45.5 36.5,43.62 36.5,19 28.66,11.16 P1.8
A3  (via drill 0.34)
  Top 0.25: U1.12 36.26,44.49 35.25,45.5 v35.25,46.69
  Bottom 0.25: v35.25,46.69 35.25,45.5 37,43.75 37,18 30.16,11.16 P1.9
A4  (via drill 0.34)
  Top 0.25: U1.13 36.76,44.62 35.94,45.44 v35.94,45.88
  Bottom 0.25: v35.94,45.88 35.94,45.44 37.5,43.88 37.5,17 31.66,11.16 P1.10
A5  (via drill 0.34)
  Top 0.25: U1.14 37.26,44.74 36.62,45.38 36.62,46.44 v36.38,46.69
  Bottom 0.25: v36.38,46.69 36.62,46.44 36.62,45.38 38,44 38,16 33.16,11.16 P1.11
A6  (via drill 0.34)
  Top 0.25: v37.31,45.69 37.31,45.31 37.76,44.87 U1.15
  Bottom 0.25: v37.31,45.69 37.31,45.31 38.5,44.12 38.5,15 34.66,11.16 P1.12
A7  (via drill 0.34)
  Top 0.25: U1.16 38.26,45.06 38,45.31 38,46 37.38,46.62 v37.38,46.69
  Bottom 0.25: v37.38,46.69 37.38,46.62 38,46 38,45.31 39,44.31 39,14 36.16,11.16 P1.13
A8  (via drill 0.34)
  Top 0.25: U1.17 38.75,45.25 38.44,45.56 38.44,46.62 v38.31,46.69
  Bottom 0.25: v38.31,46.69 38.44,46.56 38.44,45.56 39.5,44.5 39.5,12.5 37.66,10.66 P1.14
A9  (via drill 0.34)
  Top 0.25: U1.18 39.25,46 v39.12,45.88
  Bottom 0.25: v39.12,45.88 40,45 40,11.5 39.16,10.66 P1.15
A10  (via drill 0.34)
  Top 0.25: U1.21 40.75,46.81 v40.56,47
  Bottom 0.25: v40.56,47 40.5,46.62 40.5,8.5 40.66,8.34 P1.16
A11  (via drill 0.34)
  Top 0.25: U1.22 41.25,46.44 v41.5,46.69
  Bottom 0.25: v41.5,46.69 41.5,46.56 41,46.06 41,11.5 42.16,10.34 P1.17
A12  (via drill 0.34)
  Top 0.25: U1.23 41.75,45.69 v41.94,45.88
  Bottom 0.25: v41.94,45.88 41.5,45.44 41.5,12.5 43.66,10.34 P1.18
A13  (via drill 0.34)
  Top 0.25: U1.24 42.25,45.12 42.62,45.5 42.62,46.5 v42.44,46.69
  Bottom 0.25: v42.44,46.69 42.62,46.5 42.62,45.5 42,44.88 42,14 45.16,10.84 P1.19
A14  (via drill 0.34)
  Top 0.25: U1.25 42.75,44.94 43.12,45.31 43.12,46.31 v43.5,46.69
  Bottom 0.25: v43.5,46.69 43.12,46.31 43.12,45.31 42.5,44.69 42.5,15 46.66,10.84 P1.20
A15  (via drill 0.34)
  Top 0.25: U1.26 43.25,44.81 43.62,45.19 43.62,45.56 v43.81,45.75
  Bottom 0.25: v43.81,45.75 43.62,45.56 43.62,45.19 43,44.56 43,16 48.16,10.84 P1.21
BATT
  pour Bottom (isolate 0.25, rank 2): 60.5,-1 60.5,4 61,4.5 69,4.5 72.75,8.25 72.75,18.73 76.88,23.25 76.88,44.75 84,44.75 84,0 82.5,-1.5 61,-1.05
BATT_DC
  pour Top (isolate 0.25, rank 3): 76.75,56.5 76.75,53.88 67,53.88 67,51.5 83.03,51.5 83.03,56.5
CK1
  Top 0.25: U1.52 53.84,48.66 55.5,47 X1.4
  Top 0.5: X1.4 X1.1 60.52,45.85 C1.1 R25.1
CK2
  Top 0.25: U1.53 53.78,49.16 55,50.38 55.5,50.62 X1.3
  Top 0.5: X1.3 X1.2 60.52,52.15 C2.1 R25.2
CLK  (via drill 0.34)
  Top 0.25: U1.5 32.76,41.68 v33,41.94
  Bottom 0.25: v33,41.94 34,40.94 34,37.88 33,36.88 33,36.06 33.5,35.56 33.5,25 19.66,11.16 P1.2
CLS
  Top 0.25: J1.7 49.28,65.03 46.76,62.51 U1.70
CS  (via drill 0.34)
  Top 0.25: U1.8 34.26,43.62 v33.69,44.19
  Bottom 0.25: v33.69,44.19 35,42.88 35,22 24.16,11.16 P1.5
D0  (via drill 0.34)
  Top 0.25: U1.27 43.75,44.44 v44.28,44.97
  Bottom 0.25: v44.28,44.97 43.5,44.19 43.5,17 49.66,10.84 P1.22
D1  (via drill 0.34)
  Top 0.25: U1.28 44.25,43.94 45,44.69 45,45.5 v44.75,45.75
  Bottom 0.25: v44.75,45.75 45,45.5 45,44.69 44,43.69 44,18 51.16,10.84 P1.23
D2  (via drill 0.34)
  Top 0.25: U1.29 44.75,43.75 45.44,44.44 45.44,46.12 44.88,46.69 v44.75,46.69
  Bottom 0.25: v44.75,46.69 44.88,46.69 45.44,46.12 45.44,44.44 44.5,43.5 44.5,19 52.66,10.84 P1.24
D3  (via drill 0.34)
  Top 0.25: U1.30 45.25,43.56 45.88,44.19 45.88,45.69 v46.19,46
  Bottom 0.25: v46.19,46 45.88,45.69 45.88,44.19 45,43.31 45,20 54.16,10.84 P1.25
D4  (via drill 0.34)
  Top 0.25: U1.31 45.75,43.38 46.31,43.94 46.31,44.62 46.81,45.12 v46.81,45.19
  Bottom 0.25: v46.81,45.19 46.31,44.69 46.31,43.94 45.5,43.12 45.5,21 55.66,10.84 P1.26
D5  (via drill 0.34)
  Top 0.25: U1.32 46.26,43.19 46.94,43.88 46.94,44 v47,44.06
  Bottom 0.25: v47,44.06 47,43.94 46,42.94 46,22 57.16,10.84 P1.27
D6  (via drill 0.34)
  Top 0.25: U1.33 46.76,42.63 v47.12,43
  Bottom 0.25: v47.12,43 46.5,42.38 46.5,23 58.66,10.84 P1.28
D7  (via drill 0.34)
  Top 0.25: U1.34 47.26,41.94 v47.44,42.12
  Bottom 0.25: v47.44,42.12 47,41.69 47,24 60.16,10.84 P1.29
DC_JACK  (via drill 0.35)
  Top 0.25: JP1.3 75.75,33.5 v75.12,34.12
  other vias: 69,56 76.12,34.12 76.12,32.5 75.12,32.5 75.62,33.31 68.03,56 69,54.38 68.03,54.38 68.5,55.16
  pour Top (rank 2): 80.62,34.38 80.62,32.25 74.88,32.25 74.88,34.38
  pour Bottom (isolate 0.25, rank 2): 74.88,32.25 76.38,32.25 76.38,49.12 69.25,56.25 67.38,56.25 67.38,54.12 69.38,54.12 74.88,48.62
  pour Top (isolate 0.25, rank 2): 65.72,56.25 69.25,56.25 69.25,54.12 65.72,54.12
DCK
  Top 0.25: 34.76,65.87 J1.36 34.78,65.14 34.47,64.83 34.47,60.43 34.76,60.15 U1.94
ELP2  (via drill 0.34)
  Top 0.25: v11,63.5 11,68.5 11.28,68.78 FB1.1
  Bottom 0.25: EXT.OUT 7.75,53.47 7.75,58.06 9.5,59.81 9.5,62 v11,63.5
ELP3  (via drill 0.34)
  Top 0.25: v11.69,67.94 11.72,67.9 FB1.2
  Bottom 0.25: EXT.IN 8.78,54.5 10,54.5 11,55.5 11,62.5 12.5,64 12.5,67 11.69,67.81 v11.69,67.94
ELP4  (via drill 0.34)
  Top 0.25: v11.69,66.44 12.35,67.1 FB1.3
  Bottom 0.25: EXT.SD 7.25,55.51 7.25,58.25 9,60 9,62.25 10.19,63.44 10.19,65 11.62,66.44 v11.69,66.44
ELP5  (via drill 0.34)
  Top 0.25: v10.25,61.69 10.12,61.62 12,63.5 12,65.5 12.72,66.22 FB1.4
  Bottom 0.25: EXT.CLK 8.79,57 10,57 10.5,57.5 10.5,61.38 10.19,61.69 v10.25,61.69
EM10_EM8
  pour Top (isolate 0.25, rank 5): 63.24,68.81 63.24,65.5 68,65.5 68,68.81
EM10_GND  (via drill 0.34)
  other vias: 71.56,68.5 69.56,68.5 68.88,67.56 68.88,66.31
  pour Bottom (isolate 0.25, rank 2): 68.44,68.81 68.44,58.62 68.88,58.19 68.88,58.12 73.75,58.12 73.75,62 72.75,62 72.75,68.81
  pour Top (isolate 0.25, rank 2): 68.44,68.81 68.44,65.75 71.85,65.75 71.85,68.81
EM10_POS
  pour Top (isolate 0.25): 68.44,65.25 68.44,57 82.5,57 82.5,62 71.85,62 71.85,65.25
GND  (via drill 0.33, 0.34)
  Top 0.25: C41.2 39.15,38.65 39.75,39.25 U1.19 39.75,43.31 40,43.56 40,46 39.88,46.12 | C45.2 53.31,44.66 U1.44 | v39.48,61.7 39.3,61.52 39.3,60.51 C29.2 39.29,60.26 40.12,59.52 40.12,58.07 39.75,57.69 U1.84 39.76,55.01 v40,55 | v21.62,31.03 21.38,31.03 20.73,31.48 U3.4 | U2.21 21.28,56.91 v20.88,57.31 | v36.5,67.5 36.28,67.28 J1.33 | U1.108 30.34,52.16 30.5,52 v30.5,51.19 | C5.2 19.35,63.15 v19.5,63 | C6.2 C7.2 14.6,71.85 v14.56,71.81 | C1.2 64.15,44.15 v64.25,45.38 | U1.49 52.03,47.16 | U1.50 52.47,47.66 v52.5,47.88 51.97,48.16 U1.51 | U1.54 51.97,49.66 52.25,49.94 | 52.25,49.94 52.03,50.16 U1.55 | 52.25,49.94 v52.38,49.94 | U1.59 51.04,52.12 52.12,52.12 v52.38,51.88 52.16,51.66 U1.58 | 35.78,66.03 35.77,66.03 35.77,66.97 35.75,67 35.75,67.38 | J1.35 35.28,69.12 35.78,69.62 | v22.89,33.8 22.69,34 21,34 20.5,33.5 20.5,32.88 20.1,32.48 U3.2 | v54.62,36.62 54.54,36.62 53.81,37.35 C17.2 | C16.2 57.95,33.27 57.95,34.19 | 57.95,34.19 U6.3 | v59.12,34.19 57.95,34.19 | J1.35 35.28,66 | J1.35 C28.1 J1.35 | J1.35 35.28,67 | J1.35 35.28,65.5 35.27,65.5 | J1.35 35.28,65 35.27,65 | J1.34 35.75,65.92 35.75,66 | v24.72,29.03 24.84,29.15 24.85,29.15 24.73,29.03 v24.72,29.03
  Top 0.27: 35.78,69.62 J1.34 35.78,67.9 35.78,67.91 | U1.51 49.38,48.16 | U1.50 49.59,47.66 | U1.49 49.56,47.16 | U1.44 49.72,44.66 | U1.54 49.56,49.66 | C48.2 24.69,34.84
  Bottom 0.25: v20.88,57.31 15.5,51.94 v15.75,50.56 C33.2 12.97,49.35 v12.38,47.75 | v39.48,61.7 39.5,61.73 39.5,67.5 | 39.5,67.5 39.5,70.5 43,74 48.5,74 51.25,71.25 v51.25,71 | 39.5,67.5 v36.5,67.5 36.5,70.25 33.75,73 32.5,73 31,71.5 31,65.06 | v64.25,53.31 v64.25,45.38 | v52.38,51.88 52.31,51.81 v52.38,49.94 52.5,49.75 v52.5,47.88 | 29.81,33.89 29.5,34.2 | 29.81,33.11 29.71,33.01
  other vias: 24.6,34.75 31.3,64.38 22.38,30.5 21.19,30.19 23.59,29.34 24.59,36.16 36.5,70.5 38.5,70.5 48.75,71 48.75,67.5 50.75,67.5 60.5,68.5 60.5,66.5 14.56,72.81 13.56,72.81 13.56,71.81 19.56,71.81 19.56,72.81 20.56,72.81 20.56,71.81 19.5,62 20.5,63 14.5,63 13.5,63 14.5,61.5 13.5,61.5 21.81,58.25 22.75,59.19 15.75,51.56 16.75,51.56 16.75,50.56 16.75,49.56 10.88,47.75 10.88,49.62 64.25,46.38 65.25,46.38 65.25,45.38 64.25,54.31 61.75,54.81 61.75,53.81 60.75,53.81 60.75,54.81 52.38,50.88 53.38,51.88 53.38,50.88 53.38,49.94 52.5,46.88 52.5,45.88 53.5,46.88 53.5,47.88 31.12,50.5 32.38,50.5 31.75,51.19 33,51.19 41.38,55 40.69,54.25 30.69,54.25 32.69,54.25 65,9.25 66,9.25 66,8.31 66,7.31 66,6.38 65,6.38 14.38,69.88 12.56,69.88 48.88,62.44 48.88,58.19 50.75,64.44 63,57.5 66.25,51.81 66.25,49.81 66.25,47.81 67.38,43.75 58,52.56 36.5,51.19 39.5,51.19 42.5,51.19 45,50.19 46.5,47.69 2.5,2.5 7.5,2.5 9.12,4 7.5,4 7.56,0.94 9.12,0.94 2.5,7.5 2.5,12.5 2.5,22.5 2.5,32.5 2.5,42.5 1.38,54.5 75.95,77.5 15,2.5 26.35,0.8 31.35,0.8 36.35,0.8 41.35,0.8 46.35,0.8 51.35,0.8 56.35,0.8 58.85,0.8 23.85,0.8 7.5,22.5 12.5,22.5 17.5,22.5 22.5,22.5 17.5,17.5 7.5,17.5 7.5,12.5 12.5,12.5 7.5,7.5 7.5,27.5 7.5,42.5 7.5,37.5 7.5,47.5 52.5,72.7 57.5,62.5 57.5,57.5 57.5,22.5 62.5,22.5 67.5,22.5 62.5,17.5 67.5,17.5 67.5,12.5 62.5,12.5 52.5,22.5 57.5,17.5 22.5,26.25 27.5,26.25 52.5,26.25 57.5,26.25 62.5,26.25 67.5,26.25 12.38,42.5 81.25,77.5 80.5,70.5 32.5,75 37.5,75 42.5,75 47.5,75 52.5,75 27.5,75 22.5,75.75 12.5,75.75 2.5,75.75 13.25,55.75 15.75,58.25 50.5,56 49,54.5 72.5,22.5 76,70.5 62.5,68.5 64.25,44.38 38.5,55 37.75,54.25 25.74,36.16 66.75,32.38 65.62,32.38 64.5,32.38 74.75,28.25 76,28.25 76,27 74.75,27 76,25.75 74.75,25.75 76,24.5 74.75,24.5 67.38,44.84 2.56,69.88 23.85,4.92 58.85,4.92 56.35,4.92 26.35,4.92 24.72,30.16 59.1,72.3 59.1,70.9 56.3,70.9 56.3,72.3 63.9,70.9 65.3,69.6 68.8,69.6 70,71.5 76,72.9 55.1,77.4 53.35,67.3 70,73.1 71.19,42.12 38.5,67.5 40.5,67.5 42.5,67.5 44.5,67.5 40.5,70.5 42.5,70.5 44.5,70.5
  pour Top (isolate 0.25, rank 6): -2.5,80.5 -2.5,-1 -1,-2.5 85,-2.5 86.5,-1 86.5,78.5 84.5,80.5 1.5,80.5 0,82 -1,82
  pour Bottom (isolate 0.25, rank 5): -4,85 87.5,85 91.5,81 91.5,-4.5 87,-9 -6,-9 -13.5,-1.5 -13.5,75.5
  pour Top (rank 2): 63,32.03 63,33.62 67.25,33.62 67.25,32.88 69.12,32.88 69.12,33.62 70.75,33.62 70.75,32.25 69.25,32.25 69.03,32.03
HP_SWITCH  (via drill 0.34)
  Top 0.25: U3.3 19.32,32 v21.38,32 | v76.56,4 76.75,4.19 76.75,12 74.75,14 74.75,21.88 69.12,27.5 19.75,27.5 v19.5,27.75 19.4,27.65 R36.1 17.34,27.62 C51.1
  Bottom 0.25: v21.38,32 21.12,32 19.62,30.5 19.62,27.88 v19.5,27.75 | v76.56,4 74.12,4 72.69,2.56 AUDIO.1
LDB0
  Top 0.25: U1.86 38.76,57.83 38.42,58.17 38.42,61.74 39.78,63.1 J1.26
LDB1
  Top 0.25: U1.87 38.26,57.71 37.98,57.98 37.98,61.95 39.28,63.25 J1.27
LDB2
  Top 0.25: U1.88 37.76,57.58 37.53,57.81 37.53,62.16 38.78,63.4 J1.28
LDB3
  Top 0.25: U1.89 37.26,57.46 37.08,57.63 37.08,62.35 38.28,63.55 J1.29
LDB4
  Top 0.25: U1.90 36.76,57.33 36.63,57.46 36.63,62.55 37.78,63.7 J1.30
LDB5
  Top 0.25: U1.91 36.26,57.23 36.18,57.31 36.18,62.73 37.28,63.83 J1.31
LDG0
  Top 0.25: U1.78 42.78,56.43 J1.20
LDG1
  Top 0.25: J1.21 42.28,60.56 42.29,60.55 42.29,57.17 42.26,57.13 U1.79
LDG2
  Top 0.25: U1.80 41.78,56.43 41.75,56.46 41.75,56.62 41.78,56.65 41.78,57.24 41.87,57.33 41.87,60.27 41.78,60.36 J1.22
LDG3
  Top 0.25: U1.81 41.28,56.43 41.25,56.46 41.25,57.32 41.44,57.51 41.44,60.04 41.28,60.2 J1.23
LDG4
  Top 0.25: U1.82 40.78,56.43 40.75,56.46 40.75,57.44 41,57.69 41,59.86 40.78,60.09 J1.24
LDG5
  Top 0.25: U1.83 40.25,57.57 40.56,57.88 40.56,59.69 40.28,59.97 J1.25
LDR0
  Top 0.25: U1.72 45.78,56.43 J1.14
LDR1
  Top 0.25: J1.15 45.26,65.87 U1.73
LDR2
  Top 0.25: U1.74 44.78,56.43 J1.16
LDR3
  Top 0.25: J1.17 44.26,65.87 U1.75
LDR4
  Top 0.25: U1.76 43.78,56.43 J1.18
LDR5
  Top 0.25: U1.77 43.28,56.43 J1.19
LIN_AMP  (via drill 0.34)
  Top 0.25: R31.2 19.77,35 19.3,34.52 U3.1 19.3,34.42 19.13,34.59 | R30.1 18.73,35 19.13,34.59 | v19.22,34.59 19.13,34.59
  Bottom 0.25: v19.22,34.59 19.28,34.59 20,33.88 PIN1.TP
MA0  (via drill 0.34)
  Top 0.25: U1.99 32.25,57.97 v32.06,58.19 | U2.17 23.48,56.69 24.47,57.69 25.31,57.69 27.41,59.78 v27.41,60.09
  Bottom 0.25: v32.06,58.19 30.78,59.44 28.06,59.44 v27.41,60.09
MA1  (via drill 0.34)
  Top 0.25: U1.98 32.75,57.81 v32.97,58.03 | U2.16 24.02,56.59 24.69,57.25 25.56,57.25 28.34,60.03 v28.34,60.5
  Bottom 0.25: v32.97,58.03 32.97,58.22 31.19,60 29,60 28.5,60.5 v28.34,60.5
MA2  (via drill 0.34)
  Top 0.25: U1.97 33.25,55.44 32.84,55.03 v31.84,55.03 | v25.53,56.47 25.31,56.69 24.75,56.69 24.57,56.51 U2.15
  Bottom 0.25: v31.84,55.03 31.56,55.31 30.59,55.31 29.25,56.66 29.25,57.06 28.72,57.59 27.25,57.59 26.12,56.47 v25.53,56.47
MA3
  Top 0.25: U1.124 28.98,44.19 25.19,44.19 24.57,43.58 U2.14
MA4
  Top 0.25: U2.13 24.06,42.94 24.06,43.75 24.97,44.66 U1.123
MA5
  Top 0.25: U2.12 23.5,42.92 23.5,43.88 24.78,45.16 U1.122
MA6
  Top 0.25: U2.11 22.94,42.91 22.94,44 24.6,45.66 U1.121
MA7
  Top 0.25: U2.10 22.38,44.12 24.41,46.16 U1.120
MA8
  Top 0.25: U2.4 19.06,42.91 19.06,44.12 23.6,48.66 U1.115
MA9
  Top 0.25: U2.3 18.5,42.92 18.5,44.25 23.41,49.16 U1.114
MA10
  Top 0.25: U2.28 17.44,54.99 17.44,52.56 19.34,50.66 U1.111
MA11
  Top 0.25: U2.2 18,42.92 18,44.44 23.22,49.66 U1.113
MA12
  Top 0.25: U2.9 21.81,42.91 21.81,44.25 24.22,46.66 U1.119
MD0  (via drill 0.34)
  Top 0.25: U1.100 31.75,57.38 v31.12,58 | U2.18 22.94,56.01 22.94,56.84 24.25,58.16 25.09,58.16 26.41,59.47 v26.41,59.78
  Bottom 0.25: v31.12,58 31.12,57.88 30.03,58.97 27.56,58.97 26.75,59.78 v26.41,59.78
MD1  (via drill 0.34)
  Top 0.25: U1.101 31.25,55.44 30.94,55.12 30.38,55.12 30,55.5 v30,56.91 | v24.66,58.84 24.25,58.84 22.38,56.97 U2.19
  Bottom 0.25: v30,56.91 29.91,57.09 28.94,58.06 25.44,58.06 v24.66,58.84
MD2  (via drill 0.34)
  Top 0.25: U1.102 30.75,57.25 v30.19,57.81 | U2.20 21.82,57.2 24.19,59.56 25.44,59.56 v25.41,59.47
  Bottom 0.25: v30.19,57.81 29.47,58.53 26.34,58.53 v25.41,59.47
MD3
  Top 0.25: U2.22 20.75,55.48 20.75,55.31 21.4,54.66 U1.103
MD4
  Top 0.25: U2.23 20.19,55.3 20.19,55.06 21.09,54.16 U1.104
MD5
  Top 0.25: U2.24 19.62,54.81 20.78,53.66 U1.105
MD6
  Top 0.25: U2.25 19.06,54.99 19.06,54.56 20.47,53.16 U1.106
MD7
  Top 0.25: U2.26 18.56,55.96 18.56,52.88 19.78,51.66 U1.109
N$1  (via drill 0.34)
  Top 0.25: FB1.8 14.62,68.78 C7.1 17,69.15 v17,69 | v19,69 20.5,70.5 RA3A.1
  Bottom 0.25: v17,69 v19,69
N$2
  Top 0.25: RA3B.1 20.05,67.9 18,67.9 | 18,67.9 FB1.7 | C6.1 18,67.9
N$4
  Top 0.25: C52.2 17.35,36.7 R30.2
N$5
  Top 0.25: C53.2 15.65,31.49 R32.2
N$6
  Top 0.25: 14.35,67 FB1.6 18,67.1 | RA3C.1 20.05,67.1 18,67.1 | C5.1 18,67.1
N$7
  Top 0.25: VR1.P$3 15.35,36.81 C52.1
N$8
  Top 0.25: U1.6 33.26,37.85 32.9,37.5 R27.1
N$9  (via drill 0.34)
  Top 0.25: FB1.5 14.59,66.25 C4.1 17,65.85 v17,66 | v19,66 20.5,64.5 RA3D.1
  Bottom 0.25: v17,66 v19,66
N$10
  Top 0.25: VR1.P$2 13.82,32.19 14.82,33.19 C53.1
N$11
  Top 0.25: R1.1 59.12,75.72 61.38,77.98 72.13,77.98 SW1.P$4
N$13
  pour Top (isolate 0.25, rank 3): 61,62.62 61,59.38 68.5,59.38 68.5,62.62
N$15
  pour Top (isolate 0.25, rank 2): 65,60.31 68,60.31 68,56.75 65,56.75
N$16
  pour Top (rank 2): 67,51 67,46.25 69.75,46.25 69.75,51
N$24
  Top 1: EXT.GND 6.22,58.72 7.5,60 EM9.1
N$29
  Top 0.25: C49.1 25.25,30.85 24.61,31.48 U3.7
P00  (via drill 0.34)
  Top 0.25: U1.1 30.75,46.25 33,48.5 v33,49.5 | v32.88,67.5 32.28,66.9 J1.41
  Bottom 0.25: v32.88,67.5 33.19,67.19 33.19,60.31 34,59.5 34,50.69 33.25,49.94 33.25,49.62 v33,49.5
P01  (via drill 0.34)
  Top 0.25: U1.4 32.25,45.69 33.38,46.81 33.88,46.81 35.5,48.44 v35.5,48.75 | J1.42 31.78,67.53 32.56,68.31 33.44,68.31 v34.44,69.31
  Bottom 0.25: v34.44,69.31 34.44,68.71 34.69,68.46 34.69,60.88 35.5,60.06 v35.5,48.75
P02  (via drill 0.34)
  Top 0.25: U1.3 31.75,45.88 33.19,47.31 33.62,47.31 34.62,48.31 v34.62,49.03 | v33.44,69.31 32.94,68.81 32.34,68.81 31.28,67.75 J1.43
  Bottom 0.25: v34.62,49.03 34.81,49.06 34.81,49.31 35,49.5 35,59.88 34.19,60.69 34.19,68.16 33.44,68.91 v33.44,69.31
P03  (via drill 0.34)
  Top 0.25: U1.2 31.25,46.06 33.69,48.5 v33.69,48.62 | v32.44,69.81 30.78,68.15 J1.44
  Bottom 0.25: v32.44,69.81 32.44,69.11 33.69,67.86 33.69,60.5 34.5,59.69 34.5,50.06 33.69,49.25 v33.69,48.62
P10  (via drill 0.34)
  Top 0.25: v26.5,43.5 26.66,43.66 U1.125 | v29.22,55.66 29.25,55.75 29.25,58.12 30.5,59.38 30.5,62.75 30.28,62.97 J1.45
  Bottom 0.25: v26.5,43.5 26.5,55.5 27.22,56.22 28.66,56.22 v29.22,55.66
P11  (via drill 0.34)
  Top 0.25: U1.126 28.98,43.19 27.19,43.19 v26.5,42.5 | v28.12,56.91 28.78,57.38 28.78,58.34 30.03,59.59 30.03,62.5 29.78,62.75 J1.46 29.78,65.36
  Bottom 0.25: v26.5,42.5 25.75,43.25 25.75,43.84 26,44.09 26,55.69 27.31,57 28,57 v28.12,56.91
P12  (via drill 0.34)
  Top 0.25: v27.5,41.56 28,41.56 28.6,42.16 U1.128 | v28.31,55.53 27.44,56.41 27.44,57.72 29.56,59.84 29.56,62.26 29.28,62.54 J1.47
  Bottom 0.25: v27.5,41.56 28,41.56 28.5,42.06 28.5,43.72 27.5,44.72 27.5,54.5 28.31,55.31 v28.31,55.53
P13  (via drill 0.34)
  Top 0.25: v27.5,42.5 27.6,42.66 U1.127 | v27.41,55.41 27,55.81 27,58 29.06,60.06 29.06,62.03 28.78,62.32 J1.48
  Bottom 0.25: v27.5,42.5 27.5,44 27,44.5 27,55 v27.41,55.41
PFET_DRAIN
  Top 0.25: 70.88,45.88 71.25,45.88
  pour Top (isolate 0.25, rank 4): 67,51.5 67,46.25 70.25,46.25 70.25,43.75 74.12,43.75 74.12,51.5
R4  (via drill 0.34)
  Top 0.25: U1.96 33.75,58.44 v33.12,59.06 | RA3C.2 24,66.5 24.5,66 24.5,63 v25.56,61.94
  Bottom 0.25: v33.12,59.06 31.69,60.5 29.5,60.5 28.75,61.25 27.25,61.25 26.56,61.94 v25.56,61.94
RA0
  Top 0.25: U2.5 19.62,44 23.78,48.16 U1.116
RA1
  Top 0.25: U2.8 21.31,42.94 21.31,44.38 24.1,47.16 U1.118
RA1-S01
  Top 0.25: C19.2 RA1A.2
RA1-S02
  Top 0.25: C18.2 24.15,37.38 22.85,37.38 RA1B.2
RD  (via drill 0.34)
  Top 0.25: U1.7 33.76,43.06 v33.56,43.25
  Bottom 0.25: v33.56,43.25 34.5,42.31 34.5,23 22.66,11.16 P1.4
RES  (via drill 0.34)
  Top 0.25: v48.31,41.81 47.76,41.26 U1.35 | v63.44,11.5 62.78,10.84 v61.66,10.84 | U6.1 55.92,35.25 53.9,35.25 C17.1 53.5,34.88 52.77,34.15 R3.2 50.25,33.75 v49.72,34.28
  Bottom 0.25: v61.66,10.84 47.5,25 47.5,41 v48.31,41.81 49,41.12 49,39.03 50,38.03 50,36.5 49.5,36 49.5,34.5 v49.72,34.28 | v61.66,10.84 P1.30 | v61.66,10.84 61.63,10.81 | C47.1 63.44,11.46 v63.44,11.5
RIN_AMP  (via drill 0.34)
  Top 0.25: R33.2 20.65,29.64 U3.5 18.38,30.98 | R32.1 17.49,30.98 18.38,30.98 | 18.38,30.98 18.35,30.96 v18.35,30.4
  Bottom 0.25: v18.35,30.4 17.9,30.4 PIN5.TP
ROUT  (via drill 0.34, 0.35)
  Top 0.25: U3.6 23.7,30.73 22.35,29.39 R33.1 23.23,28.12 23.56,28.12 v23.56,28.15 | AUDIO.3 77.75,2.02 77.75,11.75 75.25,14.25 75.25,22.06 69.31,28 28.09,28 27.81,28.28 v27.43,28.28
  Bottom 0.203: ROUT1.TP 23.5,28.09 v23.56,28.15
  Bottom 0.25: v23.56,28.15 26.03,28.15 ROUT.TP 27.09,28.38 27.18,28.28 v27.43,28.28
RPP
  pour Top (isolate 0.25, rank 2): 61,65.5 68,65.5 68,62.75 61,62.75
S01  (via drill 0.34)
  Top 0.25: U1.37 48.75,39.56 49,39.31 49,38.5 v48.75,38.25 | v27.69,38.75 C19.1 | v48.75,29.69 48.56,29.5 29.75,29.5 v28.69,30.56
  Bottom 0.25: v48.75,38.25 48.5,38 48.5,30 v48.75,29.69 | v28.69,30.56 28.62,30.62 28.62,34.12 S01.TP 27.88,34.75 27.88,37 28.34,37.46 28.34,38.1 v27.69,38.75
S02  (via drill 0.34)
  Top 0.25: U1.38 49.25,39.81 49.5,39.56 49.5,37.69 v49.31,37.5 | C18.1 27.5,37.62 v27.69,37.81 | v28,29.88 28.88,29 49.19,29 v49.69,29.5
  Bottom 0.203: 27.53,33.39 27.44,33.48
  Bottom 0.25: v49.31,37.5 49,37.19 49,30.5 49.5,30 49.5,29.69 v49.69,29.5 | v28,29.88 27.5,30.38 27.5,31.06 S02.TP 27.75,31.31 27.75,31.5 28.15,31.9 28.15,32.77 27.53,33.39 | 27.44,33.48 27.44,37.56 v27.69,37.81
SCK  (via drill 0.34)
  Top 0.25: R26.1 53.65,41.1 52.12,42.62 51.04,42.62 U1.40 50.97,42.62 48.88,42.62 48,43.5 48,44 47.5,44.5 47.5,45.88 v47.38,46 | v46.25,71.44 46.19,71.5 32.9,71.5 28.54,67.14 27.64,67.14 v25.5,65 | v23.5,65 22.85,65 RA3D.2
  Bottom 0.25: v46.25,71.44 46.5,71.19 46.5,49.88 47.38,49 v47.38,46 | v23.5,65 v25.5,65
SIN  (via drill 0.34)
  Top 0.25: RA3B.2 23.25,67.6 28.3,67.6 32.78,72.09 46.91,72.09 v47.06,71.94 | U1.41 49.09,43.16 48.5,43.75 48.5,44.5 48.19,44.81 v48.19,45.12
  Bottom 0.25: v48.19,45.12 48.06,45.25 48.06,49 47,50.06 47,71.88 v47.06,71.94
SOUT  (via drill 0.34)
  Top 0.25: RA3A.2 22.55,70.7 30.69,70.7 32.58,72.59 47.33,72.59 47.73,72.19 v47.94,72.19 | U1.42 49.4,43.66 49,44.06 49,45.5 48.75,45.75 v48.75,45.88
  Bottom 0.25: v47.94,72.19 47.94,71.81 47.5,71.38 47.5,50.25 48.75,49 v48.75,45.88
SPK+  (via drill 0.34)
  Top 0.25: v25.59,60.56 26.59,60.56 28.28,62.25 J1.49 | U3.8 23.71,32 27,32 v27.5,32.5
  Bottom 0.203: SPK+.TP 26.97,40.12
  Bottom 0.25: v25.59,60.56 24.56,60.56 23.97,59.97 23.97,56.91 25.5,55.38 25.5,44.47 25.22,44.19 25.22,42.78 26.97,41.03 26.97,40.12 26.97,33 27.47,32.5 v27.5,32.5
SPK-  (via drill 0.34)
  Top 0.25: R31.1 22.73,35 23.7,34.02 U3.10 23.71,33 24.5,33 24.78,33.28 v24.78,33.69 | v27.25,29.22 27.5,28.97 27.88,28.97 28.34,28.5 69.5,28.5 75.75,22.25 75.75,14.5 80.25,10 80.25,2.5 80.5,2.25 80.5,2.19 AUDIO.4 | J1.50 27.78,62.78 v26.25,61.25
  Bottom 0.203: SPK-.TP 26.5,40.12
  Bottom 0.25: v26.25,61.25 24.5,61.25 23.5,60.25 23.5,56.62 25,55.12 25,44.66 24.72,44.38 24.72,42.5 26.5,40.72 26.5,40.12 26.5,35.41 v24.78,33.69 26.25,32.22 LOUT.TP 26.34,30 27.12,29.22 v27.25,29.22
SPL
  Top 0.25: U1.71 46.28,56.43 J1.13
SPS
  Top 0.25: J1.6 49.78,64.87 47.26,62.35 U1.69
SW1B
  pour Bottom (isolate 0.25, rank 3): 76.88,44.75 76.88,49.38 72.75,53.5 72.75,58.12 81,58.12 82,57.12 82,44.75
VCC  (via drill 0.35)
  other vias: 77.25,49.25 77.25,48.12 77.25,47 77.25,45.88
  pour Top (isolate 0.25): 74.25,51 74.25,43.12 72.25,43.12 72.25,41.75 74.88,41.75 74.88,34.88 82.98,34.88 83,51
  pour Bottom (isolate 0.25): 76.88,45.25 76.88,49.38 69.5,56.75 67.25,56.75 66.12,57.88 66.12,72.25 67.94,72.25 67.94,59.44 69,58.38 74.62,58.38 74.62,52.88 77.62,49.88 77.62,45.25
VCC_SW  (via drill 0.34, 0.35)
  Top 0.25: v81.94,58.5 82.25,58.19 82.25,40.33 JP1.5 | SW1.P$1 69.7,72.26 68.3,70.86 67.13,70.86 66.39,71.6 v65.39,71.6 | v52.5,71.6 52.28,71.38 52.28,69.4 | 52.28,69.4 J1.1 | J1.2 51.78,68.9 52.28,69.4
  Bottom 0.25: v81.94,58.5 82.25,58.81 82.25,70.44 80.75,71.94 72.31,71.94 71.99,72.26 SW1.P$1 | v65.39,71.6 v52.5,71.6
VIN  (via drill 0.34)
  Top 0.25: U1.36 v48.26,39.01 v48.25,39
  Bottom 0.25: v48.26,39.01 48,38.75 48,25.88 63.16,10.71 P1.31
VR1-S01
  Top 0.25: VR1.P$5 13.35,38.75 RA1A.1
VR1-S02
  Top 0.25: RA1B.1 19.02,36.88 18.15,37.75 14.57,37.75 12.95,36.13 VR1.P$4
WR  (via drill 0.34)
  Top 0.25: R27.2 33.75,36.9 v33.75,36.25
  Bottom 0.25: v33.75,36.25 34,36 34,24 21.16,11.16 P1.3

### Text on the board
tNames: RA3 | A | B | C | D | DC- | DC+ | BIN | BOUT | 52256 | 8.388 | B | SW | BAT | DC | 5V | GND | HP | GND | ROUT | LOUT
bNames: 5V | DC- | DC+ | VCC | SOUT | CLK | SD | SIN | BATT IN | GND | 5V | BATT / OUT | 3.3V | SW | BAT | GND | RIN / LIN / LOUT / ROUT / GND | PIN1 | DC | HP-L | 5V | PIN5 | HP-R | GND | 32 | 1 | HP | GND | ROUT | LOUT | - | +
tStop: -NOT FOR OEM SCREENS- | v1.3 | DMGC-CPU-01